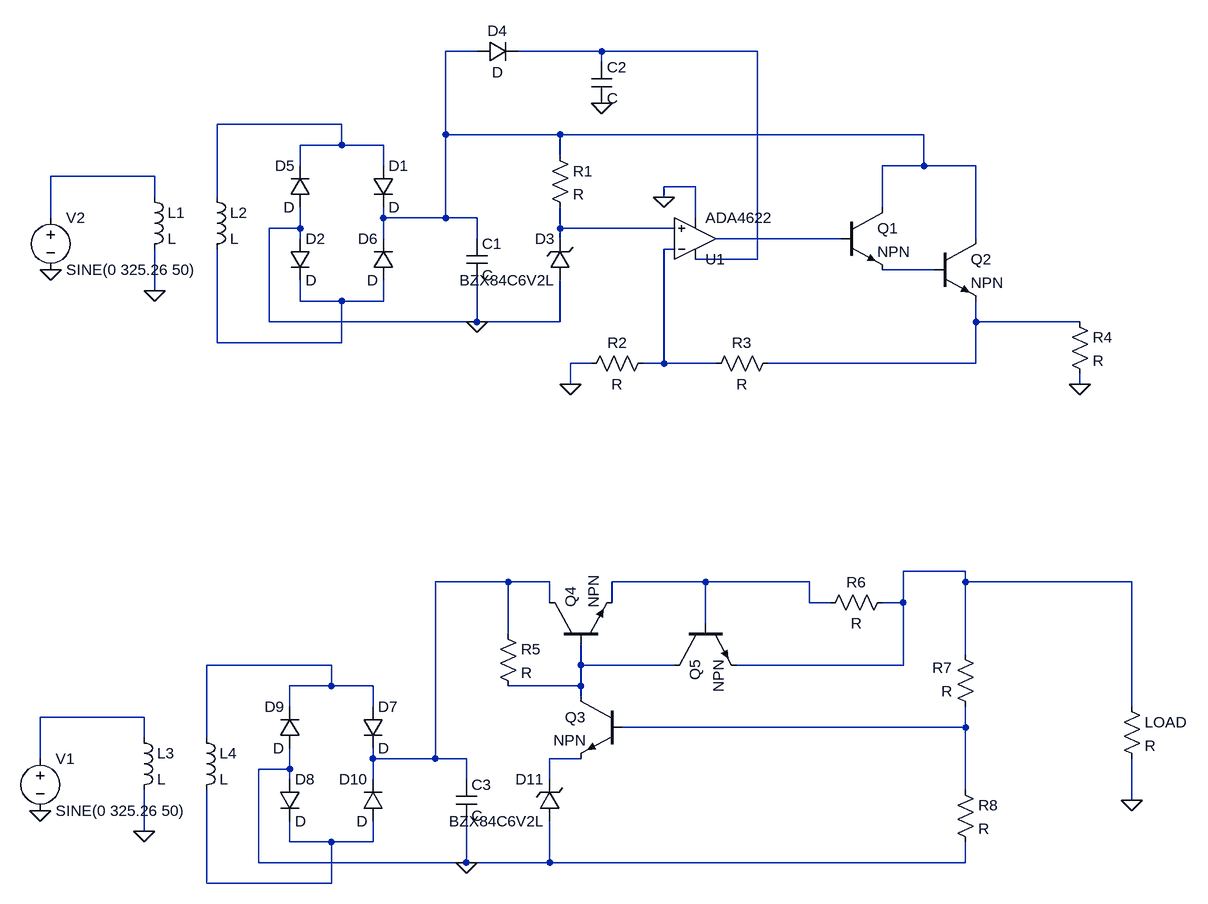
[diagram p0: schematic Basic1.asc]
Basic1.asc, the LTspice schematic file:
Version 4
SHEET 1 2024 1188
WIRE 880 -96 832 -96
WIRE 1072 -96 944 -96
WIRE 1312 -96 1072 -96
WIRE 1072 -80 1072 -96
WIRE 672 16 480 16
WIRE 832 32 832 -96
WIRE 1008 32 832 32
WIRE 1568 32 1008 32
WIRE 672 48 672 16
WIRE 672 48 608 48
WIRE 736 48 672 48
WIRE 1008 64 1008 32
WIRE 608 80 608 48
WIRE 736 80 736 48
WIRE 1568 80 1568 32
WIRE 1568 80 1504 80
WIRE 1648 80 1568 80
WIRE 384 96 224 96
WIRE 1216 112 1168 112
WIRE 384 128 384 96
WIRE 480 128 480 16
WIRE 1168 128 1168 112
WIRE 1504 144 1504 80
WIRE 224 160 224 96
WIRE 736 160 736 144
WIRE 832 160 832 32
WIRE 832 160 736 160
WIRE 880 160 832 160
WIRE 1216 160 1216 112
WIRE 608 176 608 144
WIRE 608 176 560 176
WIRE 1008 176 1008 144
WIRE 1184 176 1008 176
WIRE 608 192 608 176
WIRE 736 192 736 160
WIRE 880 192 880 160
WIRE 1008 192 1008 176
WIRE 1440 192 1248 192
WIRE 1648 192 1648 80
WIRE 1184 208 1168 208
WIRE 1312 224 1312 -96
WIRE 1312 224 1216 224
WIRE 1584 240 1504 240
WIRE 384 272 384 208
WIRE 608 288 608 256
WIRE 672 288 608 288
WIRE 736 288 736 256
WIRE 736 288 672 288
WIRE 560 320 560 176
WIRE 880 320 880 256
WIRE 880 320 560 320
WIRE 1008 320 1008 256
WIRE 1008 320 880 320
WIRE 1648 320 1648 288
WIRE 1808 320 1648 320
WIRE 480 352 480 208
WIRE 672 352 672 288
WIRE 672 352 480 352
WIRE 1056 384 1024 384
WIRE 1168 384 1168 208
WIRE 1168 384 1136 384
WIRE 1248 384 1168 384
WIRE 1648 384 1648 320
WIRE 1648 384 1328 384
WIRE 1024 416 1024 384
WIRE 1808 416 1808 400
WIRE 1632 704 1536 704
WIRE 928 720 816 720
WIRE 992 720 928 720
WIRE 1232 720 1088 720
WIRE 1392 720 1232 720
WIRE 1632 720 1632 704
WIRE 1888 720 1632 720
WIRE 992 752 992 720
WIRE 1088 752 1088 720
WIRE 1392 752 1392 720
WIRE 1424 752 1392 752
WIRE 1536 752 1536 704
WIRE 1536 752 1504 752
WIRE 1232 784 1232 720
WIRE 928 800 928 720
WIRE 1632 832 1632 720
WIRE 656 848 464 848
WIRE 1040 848 1040 816
WIRE 1184 848 1040 848
WIRE 1536 848 1536 752
WIRE 1536 848 1280 848
WIRE 656 880 656 848
WIRE 656 880 592 880
WIRE 720 880 656 880
WIRE 1040 880 1040 848
WIRE 1040 880 928 880
WIRE 1040 896 1040 880
WIRE 592 912 592 880
WIRE 720 912 720 880
WIRE 1888 912 1888 720
WIRE 368 928 208 928
WIRE 1632 944 1632 912
WIRE 1632 944 1104 944
WIRE 368 960 368 928
WIRE 464 960 464 848
WIRE 208 992 208 928
WIRE 720 992 720 976
WIRE 816 992 816 720
WIRE 816 992 720 992
WIRE 864 992 816 992
WIRE 1040 992 992 992
WIRE 592 1008 592 976
WIRE 592 1008 544 1008
WIRE 592 1024 592 1008
WIRE 720 1024 720 992
WIRE 864 1024 864 992
WIRE 992 1024 992 992
WIRE 1632 1040 1632 944
WIRE 1888 1056 1888 992
WIRE 368 1104 368 1040
WIRE 592 1120 592 1088
WIRE 656 1120 592 1120
WIRE 720 1120 720 1088
WIRE 720 1120 656 1120
WIRE 544 1152 544 1008
WIRE 864 1152 864 1088
WIRE 864 1152 544 1152
WIRE 992 1152 992 1088
WIRE 992 1152 864 1152
WIRE 1632 1152 1632 1120
WIRE 1632 1152 992 1152
WIRE 464 1184 464 1040
WIRE 656 1184 656 1120
WIRE 656 1184 464 1184
FLAG 224 240 0
FLAG 384 272 0
FLAG 880 320 0
FLAG 1024 416 0
FLAG 1168 128 0
FLAG 1808 416 0
FLAG 1072 -16 0
FLAG 208 1072 0
FLAG 368 1104 0
FLAG 864 1152 0
FLAG 1888 1056 0
SYMBOL voltage 224 144 R0
WINDOW 123 0 0 Left 0
WINDOW 39 0 0 Left 0
SYMATTR InstName V2
SYMATTR Value SINE(0 325.26 50)
SYMBOL ind 368 112 R0
SYMATTR InstName L1
SYMATTR SpiceLine Rser=0.001
SYMBOL ind 464 112 R0
SYMATTR InstName L2
SYMBOL diode 720 80 R0
SYMATTR InstName D1
SYMBOL diode 592 192 R0
SYMATTR InstName D2
SYMBOL diode 624 144 R180
WINDOW 0 24 64 Left 2
WINDOW 3 24 0 Left 2
SYMATTR InstName D5
SYMBOL diode 752 256 R180
WINDOW 0 24 64 Left 2
WINDOW 3 24 0 Left 2
SYMATTR InstName D6
SYMBOL cap 864 192 R0
SYMATTR InstName C1
SYMBOL res 992 48 R0
SYMATTR InstName R1
SYMBOL res 1152 368 R90
WINDOW 0 0 56 VBottom 2
WINDOW 3 32 56 VTop 2
SYMATTR InstName R2
SYMBOL res 1344 368 R90
WINDOW 0 0 56 VBottom 2
WINDOW 3 32 56 VTop 2
SYMATTR InstName R3
SYMBOL zener 1024 256 R180
WINDOW 0 24 64 Left 2
WINDOW 3 24 0 Left 2
SYMATTR InstName D3
SYMATTR Value BZX84C6V2L
SYMATTR Description Diode
SYMATTR Type diode
SYMBOL OpAmps\\ADA4622 1216 256 M180
SYMATTR InstName U1
SYMBOL diode 880 -80 R270
WINDOW 0 32 32 VTop 2
WINDOW 3 0 32 VBottom 2
SYMATTR InstName D4
SYMBOL cap 1056 -80 R0
SYMATTR InstName C2
SYMBOL npn 1440 144 R0
SYMATTR InstName Q1
SYMBOL npn 1584 192 R0
SYMATTR InstName Q2
SYMBOL res 1792 304 R0
SYMATTR InstName R4
SYMBOL voltage 208 976 R0
WINDOW 123 0 0 Left 0
WINDOW 39 0 0 Left 0
SYMATTR InstName V1
SYMATTR Value SINE(0 325.26 50)
SYMBOL ind 352 944 R0
SYMATTR InstName L3
SYMATTR SpiceLine Rser=0.001
SYMBOL ind 448 944 R0
SYMATTR InstName L4
SYMBOL diode 704 912 R0
SYMATTR InstName D7
SYMBOL diode 576 1024 R0
SYMATTR InstName D8
SYMBOL diode 608 976 R180
WINDOW 0 24 64 Left 2
WINDOW 3 24 0 Left 2
SYMATTR InstName D9
SYMBOL diode 736 1088 R180
WINDOW 0 24 64 Left 2
WINDOW 3 24 0 Left 2
SYMATTR InstName D10
SYMBOL cap 848 1024 R0
SYMATTR InstName C3
SYMBOL zener 1008 1088 R180
WINDOW 0 24 64 Left 2
WINDOW 3 24 0 Left 2
SYMATTR InstName D11
SYMATTR Value BZX84C6V2L
SYMATTR Description Diode
SYMATTR Type diode
SYMBOL npn 1104 896 M0
SYMATTR InstName Q3
SYMBOL npn 992 816 R270
SYMATTR InstName Q4
SYMBOL npn 1184 784 M90
SYMATTR InstName Q5
SYMBOL res 912 784 R0
SYMATTR InstName R5
SYMBOL res 1520 736 R90
WINDOW 0 0 56 VBottom 2
WINDOW 3 32 56 VTop 2
SYMATTR InstName R6
SYMBOL res 1648 928 R180
WINDOW 0 36 76 Left 2
WINDOW 3 36 40 Left 2
SYMATTR InstName R7
SYMBOL res 1616 1024 R0
SYMATTR InstName R8
SYMBOL res 1872 896 R0
SYMATTR InstName LOAD

The netlist it stands for:
* Basic1.asc
V2 N004 0 SINE(0 325.26 50)
L1 N004 0 L Rser=0.001
L2 N003 N009 L
D1 N003 N001 D
D2 0 N009 D
D5 0 N003 D
D6 N009 N001 D
C1 N001 0 C
R1 N001 N005 R
R2 N007 0 R
R3 N010 N007 R
D3 0 N005 BZX84C6V2L
XU1 N005 N007 N002 0 N006 ADA4622  ; pins In+ In- V+ V- OUT
D4 N001 N002 D
C2 N002 0 C
Q1 N001 N006 N008 0 NPN
Q2 N001 N008 N010 0 NPN
R4 N010 0 R
V1 N016 0 SINE(0 325.26 50)
L3 N016 0 L Rser=0.001
L4 N014 N019 L
D7 N014 N012 D
D8 0 N019 D
D9 0 N014 D
D10 N019 N012 D
C3 N012 0 C
D11 0 N018 BZX84C6V2L
Q3 N015 N017 N018 0 NPN
Q4 N012 N015 N013 0 NPN
Q5 N015 N013 N011 0 NPN
R5 N012 N015 R
R6 N011 N013 R
R7 N017 N011 R
R8 N017 0 R
R§LOAD N011 0 R
.model D D
.lib standard.dio
.model NPN NPN
.model PNP PNP
.lib standard.bjt
.lib ADA4622.lib
.backanno
.end